# EAGLE design V3.8 - placa embutida rele (EAGLE 9.6.2)
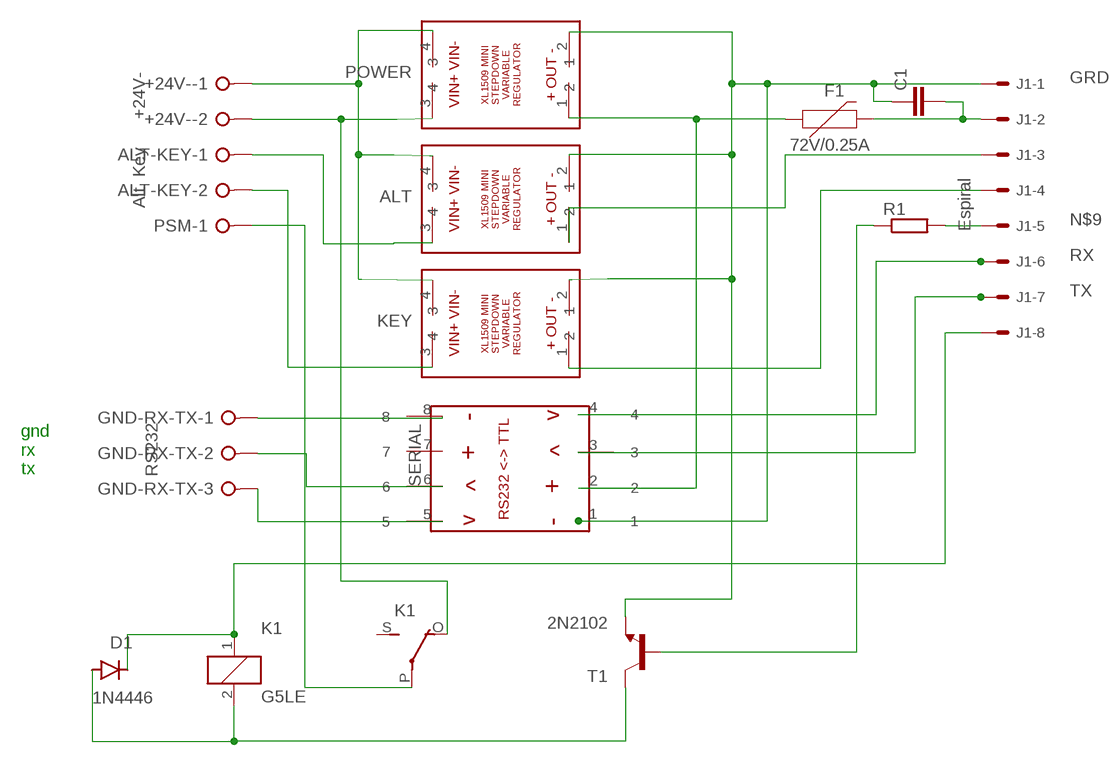
[diagram p0: schematic, sheet 1]

## Parts
+24V-  +24V-  W237-02P  [W237-132]
ALT  XL1509WITH_SMDPADS&THROUGHHOLES  [XL1509]
ALT-KEY  Alt Key  W237-02P  [W237-132]
C1  C2,5-3  [C2.5-3]
D1  1N4446  [DO35-10]
F1  72V/0.25A  PPTC_PTH  [PTH]
GND-RX-TX  RS232  W237-03P  [W237-133]
J1  Espiral  22-05-7088-08  [7395-08]
K1  G5LE  [G5LE]
KEY  XL1509WITH_SMDPADS&THROUGHHOLES  [XL1509]
POWER  XL1509WITH_SMDPADS&THROUGHHOLES  [XL1509]
PSM  PSM  W237-02P  [W237-132]
R1  R-EU_0207/10  [0207/10]
SERIAL  MAX3232WITH_SMDPADS&THROUGHHOLES  [MAX3232]
T1  2N2102  [TO5]

## Nets
CHAVE: ALT.1 J1.3
GRD: ALT.2 C1.1 J1.1 KEY.2 POWER.2 SERIAL.1 T1.1(E)
N$1: +24V-.1 ALT.4 KEY.4 POWER.4
N$2: +24V-.2 K1.O(2:O) POWER.3
N$3: F1.P$1 POWER.1 SERIAL.2
N$4: GND-RX-TX.1 SERIAL.8
N$5: ALT-KEY.1 ALT.3
N$6: ALT-KEY.2 KEY.3
N$7: GND-RX-TX.2 SERIAL.6
N$8: GND-RX-TX.3 SERIAL.5
N$9: J1.5 R1.2
N$10: R1.1 T1.2(B)
N$11: C1.2 F1.P$2 J1.2
N$20: J1.4 KEY.1
N$38: D1.A K1.2 T1.3(C)
N$39: D1.C J1.8 K1.1
N$40: K1.P(2:P) PSM.1
RX: J1.6 SERIAL.4
TX: J1.7 SERIAL.3
Unconnected: K1.S(2:S) PSM.2 SERIAL.7

## Notes on the sheet
- gnd
  rx
  tx

## Library data of the parts
+24V- ALT-KEY PSM = con-wago-508:W237-02P: WAGO SREW CLAMP; OC_FARNELL: unknown; OC_NEWARK: unknown
ALT KEY POWER = XL1509 MINI STEPDOWN BUCK MODULE:XL1509: XL1509 Mini Stepdown Buck Module
C1 = capacitor-wima:C: CAPACITOR naming: grid - package width
D1 = diode:1N4446: DIODE high speed (Philips)
F1 = SparkFun-Fuses:PPTC: Resettable Fuse PPTC Resettable Fuse. Really a sort of resistor with a polymeric positive temperature coefficient whose resistance increases dramatically with an increase in temperature. When heated by the power passing through the resistance rises causing the current to be limited, protecting the circuit. This is achieved by the transition of the polymer from a crystalline to an amorphous state where the conductive carbon separates breaking the conductive pathways found in the cool crystalline structure. When a PPTC cools back down it resumes conducting letting the circuit turn back on. SparkFun Products: SparkFun RedBoard - Programmed with Arduino <https://www.sparkfun.com/products/12757> Pro Micro - 5V/16MHz <https://www.sparkfun.com/products/12640> Arduino Pro 328 - 5V/16MHz <https://www.sparkfun.com/products/10915> MP3 Trigger <https://www.sparkfun.com/products/13720>; PROD_ID: RES-08490
GND-RX-TX = con-wago-508:W237-03P: WAGO SREW CLAMP; OC_FARNELL: unknown; OC_NEWARK: unknown
J1 = con-molex:22-?-08: CONNECTOR wire to board 2.54 mm (.1 inch) pitch header; MF: MOLEX; OC_FARNELL: unknown; OC_NEWARK: unknown
K1 = relay:G5LE: RELAY 1 x switch, 10 A/120 V AC, 8 A/30 V DC, Omron; OC_FARNELL: unknown; OC_NEWARK: unknown
R1 = rcl:R-EU_: RESISTOR, European symbol; SPICEPREFIX: R
SERIAL = MINI RS232 TLP MAX3232:MAX3232: Mini RS232 to TTL Converter
T1 = transistor:2N2102: NPN TRANSISTOR

## Module LDR
Ports: 

### Library data of the parts

## Net classes
1 New Class: width 0.5 mm, drill 1 mm

## Board
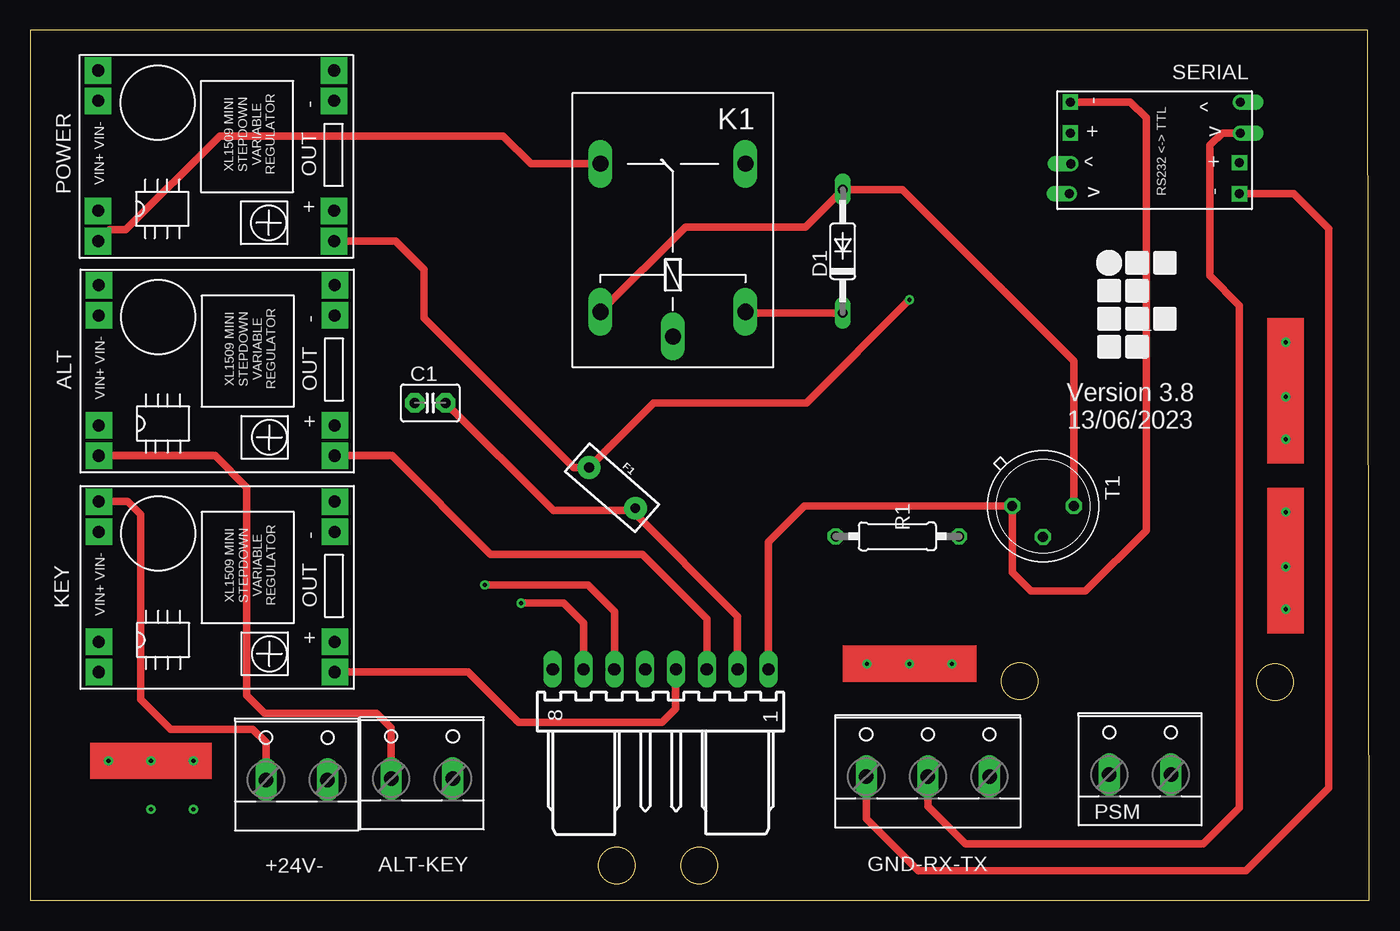
[diagram p1: board, top side]
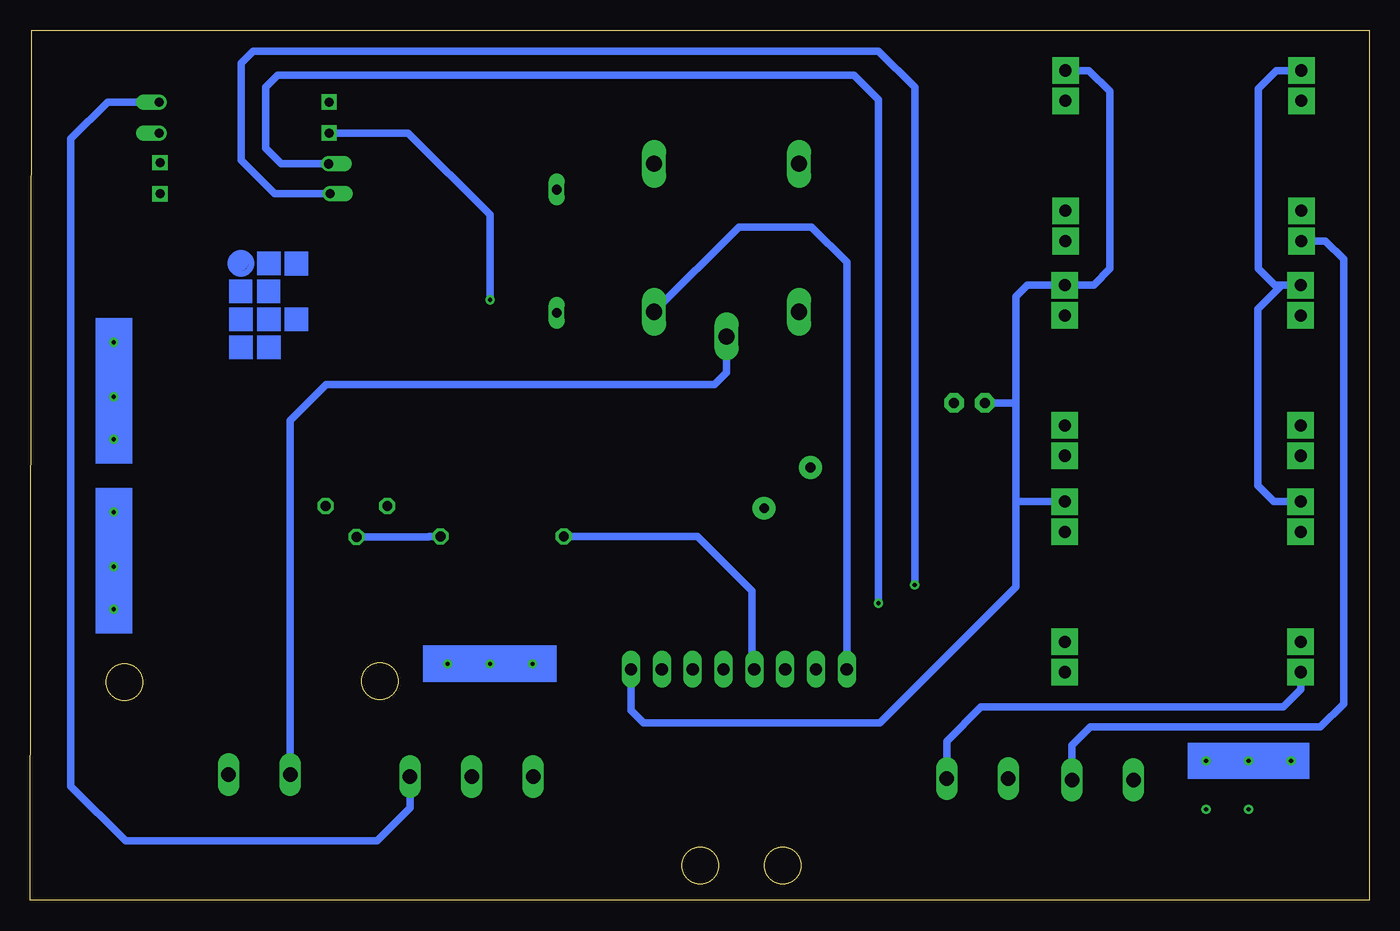
[diagram p2: board, bottom side, seen from below]

Size 110.32 x 71.7 mm. Coordinates in mm from the lower left corner, seen from the top.
Outline: 0,0 110.32,0 110.2,71.7 0,71.7 0,0
Outline: circle at 102.55,17.99 radius 1.5
Outline: circle at 81.51,18.05 radius 1.5
Outline: circle at 48.31,2.85 radius 1.5
Outline: circle at 55.11,2.85 radius 1.5
Copper layers (1*16): Top 0.035mm / dielectric 1.5mm / Bottom 0.035mm
Design rules "default *": minimum track width 6mil, minimum drill 0.35mm, track to track 6mil, track to pad 6mil, pad to pad 6mil, via to via 6mil, smd to smd 6mil, copper to edge 40mil, drill to drill 6mil, minimum pad ring 10mil, minimum via ring 8mil, stop-mask expansion 4mil, vias tented up to drill 0mil, thermal gap 10mil

### Footprints (pad centres in the part's own frame; a part is rotated, then mirrored left to right if it is on the bottom)
W237-132 = drill 1.194 long: 1 -2.54,-0.635; 2 2.54,-0.635
XL1509 = drill 1 pad 2.184 square: 1 -7.1,-8.431; 2 6.96,-8.431; 3 -7.1,11; 4 6.96,11; 5 -4.6,-8.431; 6 4.46,-8.431; 7 -4.6,11; 8 4.46,11
C2.5-3 = drill 0.813 pad 1.6 octagon: 1 -1.27,0; 2 1.27,0
DO35-10 = drill 0.813 long: A 5.08,0; C -5.08,0
PTH = drill 0.8 pad 1.88: P$1 -2.54,0; P$2 2.54,0
W237-133 = drill 1.194 long: 1 -5.08,-0.635; 2 0,-0.635; 3 5.08,-0.635
7395-08 = drill 1.016 long: 1 8.89,0; 2 6.35,0; 3 3.81,0; 4 1.27,0; 5 -1.27,0; 6 -3.81,0; 7 -6.35,0; 8 -8.89,0
G5LE = drill 1.321 long: 1 -7.493,-5.969; 2 -7.493,5.969; O 4.699,5.969; P -9.525,0; S 4.699,-5.969
0207/10 = drill 0.813 octagon: 1 -5.08,0; 2 5.08,0
MAX3232 = drill 0.75 pad 1.27 square: 1 -7.6,-2.431; 2 -5.04,-2.431; 7 -2.6,11.5; 8 -0.04,11.5 | drill 0.75 pad 1.27 offset: 3 -2.5,-2.4; 4 -0.04,-2.5; 5 -7.6,11.569; 6 -5.04,11.569
TO5 = drill 0.813 octagon: 1 0,-2.54; 2 2.54,0; 3 0,2.54

### Placement (x,y rotation side)
+24V-  21.95,10.56 0 top
ALT  16.65,43.74 90 top
ALT-KEY  32.27,10.66 0 top
C1  32.94,40.99 0 top
D1  66.94,53.49 90 top
F1  47.94,33.99 318.8 top
GND-RX-TX  73.96,10.83 0 top
J1  51.93,19.03 0 top
K1  52.94,55.99 90 top
KEY  16.65,25.91 90 top
POWER  16.59,61.43 90 top
PSM  91.44,10.99 0 top
R1  71.44,29.99 180 top
SERIAL  88.13,58.19 270 top
T1  83.44,32.49 270 top

### Tracks (layer width: path | path; a pad name or v marks a point on that pad's centre or on a via)
CHAVE
  Top 0.61: J1.3 55.74,23.2 50.44,28.49 37.94,28.49 29.8,36.64 ALT.1
GRD
  Top 0.61: J1.1 60.82,29.53 63.78,32.49 T1.1 80.9,27.03 82.44,25.49 86.94,25.49 91.94,30.49 91.94,64.49 90.64,65.79 SERIAL.1
  Bottom 0.61: J1.1 60.82,15.66 59.79,14.62 40.31,14.62 29.1,25.83 29.1,32.87 | 29.1,32.87 KEY.2 | 29.1,40.99 29.1,49.76 28.16,50.7 ALT.2 22.68,50.7 22.7,50.72 21.38,52.04 21.38,66.68 23.08,68.39 POWER.2 | 29.1,40.99 29.1,32.87 | C1.1 29.1,40.99
N$1
  Top 0.61: KEY.4 8.04,32.87 9.09,31.82 9.09,16.57 11.55,14.11 18.3,14.11 19.41,13 +24V-.1
  Bottom 0.61: KEY.4 7.85,32.87 9.18,34.2 9.18,48.73 7.21,50.7 ALT.4 7.79,50.7 9.14,52.05 9.14,66.89 7.64,68.39 POWER.4
N$2
  Top 0.61: K1.O 41.24,60.69 38.94,62.99 15.59,62.99 7.87,55.28 6.54,55.28 POWER.3
  Bottom 0.61: +24V-.2 24.49,12.77 22.98,14.28 4.01,14.28 2.11,16.18 2.11,52.84 3.6,54.33 POWER.3
N$3  (via drill 0.35)
  Top 0.61: POWER.1 30.11,54.33 32.44,51.99 32.44,47.99 44.77,35.67 F1.P$1 51.36,40.99 63.94,40.99 v72.44,49.49
  Bottom 0.61: v72.44,49.49 72.44,56.49 79.18,63.23 SERIAL.2
N$4
  Top 0.61: SERIAL.8 104.1,58.23 107,55.34 107,9.26 100.16,2.41 73.18,2.41 68.88,6.71 GND-RX-TX.1
N$5
  Top 0.61: ALT-KEY.1 29.73,14.23 28.53,15.43 19.29,15.43 17.84,16.88 17.84,34.04 15.24,36.64 ALT.3
N$6
  Bottom 0.61: ALT-KEY.2 34.81,13.09 31.97,15.92 7.1,15.92 5.65,17.37 KEY.3
N$7
  Top 0.61: SERIAL.6 98.2,63.23 97.2,62.23 97.2,58.25 97.17,58.23 97.17,51.48 99.62,49.03 99.62,7.62 96.66,4.66 77.04,4.66 73.96,7.75 GND-RX-TX.2
N$8
  Bottom 0.61: SERIAL.5 103.94,65.79 106.97,62.77 106.97,9.41 102.47,4.91 81.77,4.91 79.04,7.64 GND-RX-TX.3
N$9
  Bottom 0.61: R1.2 55.36,29.99 50.86,25.49 50.86,19.24 J1.5
N$10
  Bottom 0.61: T1.2 77.48,29.95 77.44,29.99 R1.1
N$11
  Top 0.61: F1.P$2 50.06,32.11 49.56,32.11 | 49.56,32.11 58.28,23.39 J1.2 | C1.2 43.09,32.11 49.56,32.11
N$14  (via drill 0.35)
  other vias: 6.44,11.49
N$15  (via drill 0.35)
  other vias: 13.44,11.49
N$16  (via drill 0.35)
  other vias: 9.94,11.49
N$18  (via drill 0.35)
  other vias: 9.94,7.49
N$19  (via drill 0.35)
  other vias: 13.44,7.49
N$20
  Top 0.61: J1.4 53.17,19 53.17,15.77 52.07,14.67 40.21,14.67 36.08,18.81 KEY.1
N$21  (via drill 0.35)
  other vias: 68.94,19.49
N$22  (via drill 0.35)
  other vias: 75.94,19.49
N$23  (via drill 0.35)
  other vias: 72.44,19.49
N$24  (via drill 0.35)
  other vias: 103.44,45.99
N$25  (via drill 0.35)
  other vias: 103.44,37.99
N$26  (via drill 0.35)
  other vias: 103.44,41.49
N$27  (via drill 0.35)
  other vias: 103.44,31.99
N$28  (via drill 0.35)
  other vias: 103.44,23.99
N$29  (via drill 0.35)
  other vias: 103.44,27.49
N$38
  Top 0.61: K1.2 53.97,55.49 63.86,55.49 D1.A | 67.44,58.57 D1.A | T1.3 85.98,44.45 71.86,58.57 D1.A
N$39
  Top 0.61: 66.5,48.41 D1.C 59,48.41 K1.1
  Bottom 0.61: K1.1 51.92,55.49 45.94,55.49 43.04,52.59 J1.8
N$40
  Bottom 0.61: PSM.1 88.9,39.53 85.94,42.49 53.94,42.49 52.94,43.49 K1.P
RX  (via drill 0.35)
  Top 0.61: J1.6 48.12,23.82 45.94,25.99 v37.44,25.99
  Bottom 0.61: J1.6 48.1,19.06 | v37.44,25.99 37.44,66.99 40.44,69.99 91.94,69.99 92.94,68.99 92.94,60.99 90.18,58.23 SERIAL.4
TX  (via drill 0.35)
  Top 0.61: J1.7 45.58,22.86 43.94,24.49 v40.44,24.49
  Bottom 0.61: J1.7 45.55,19.07 | v40.44,24.49 40.44,65.99 42.44,67.99 89.94,67.99 90.94,66.99 90.94,61.99 89.64,60.69 SERIAL.3
(copper drawn outside any net)
  shapes: Bottom area x13, Bottom circle x3, Top area x4

### Text on the board
tNames: Version 3.8 / 13/06/2023